# EasyEDA Pro project G-CU ver 2.0.B.eprj, board PCB1
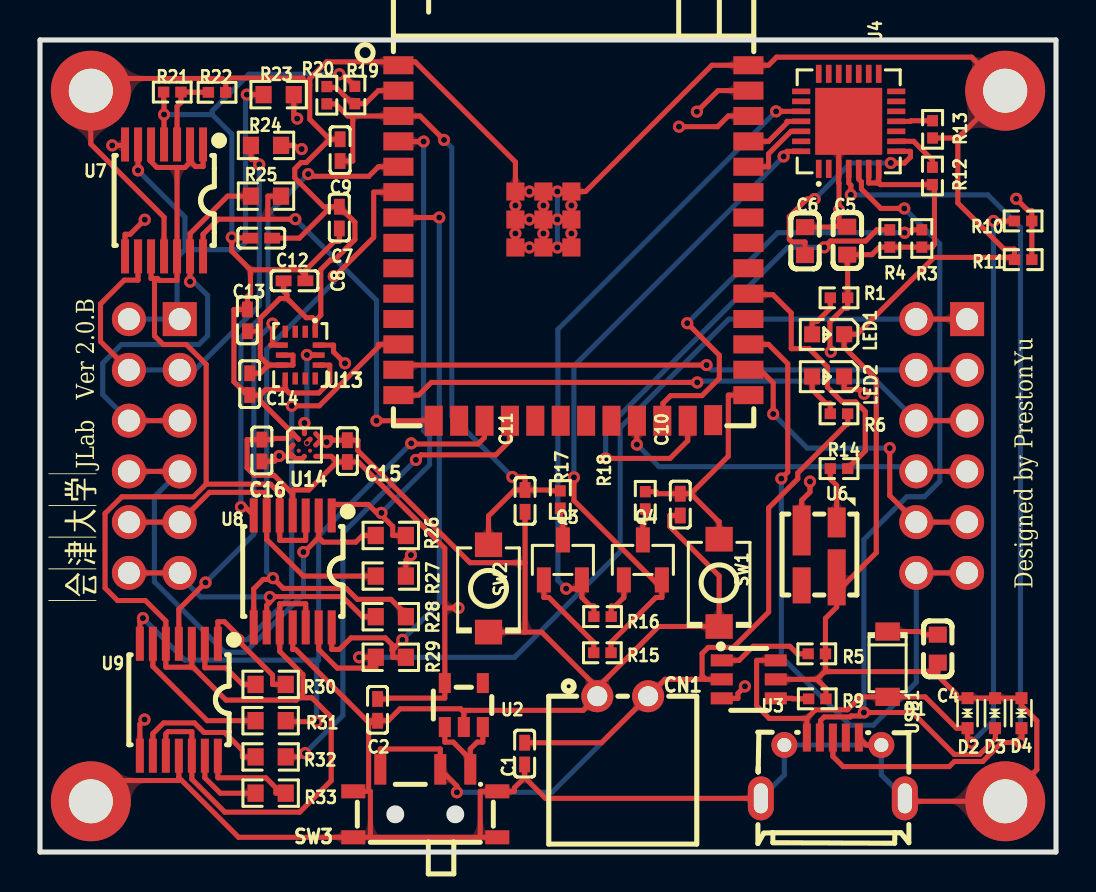
[diagram p2: board, top side]
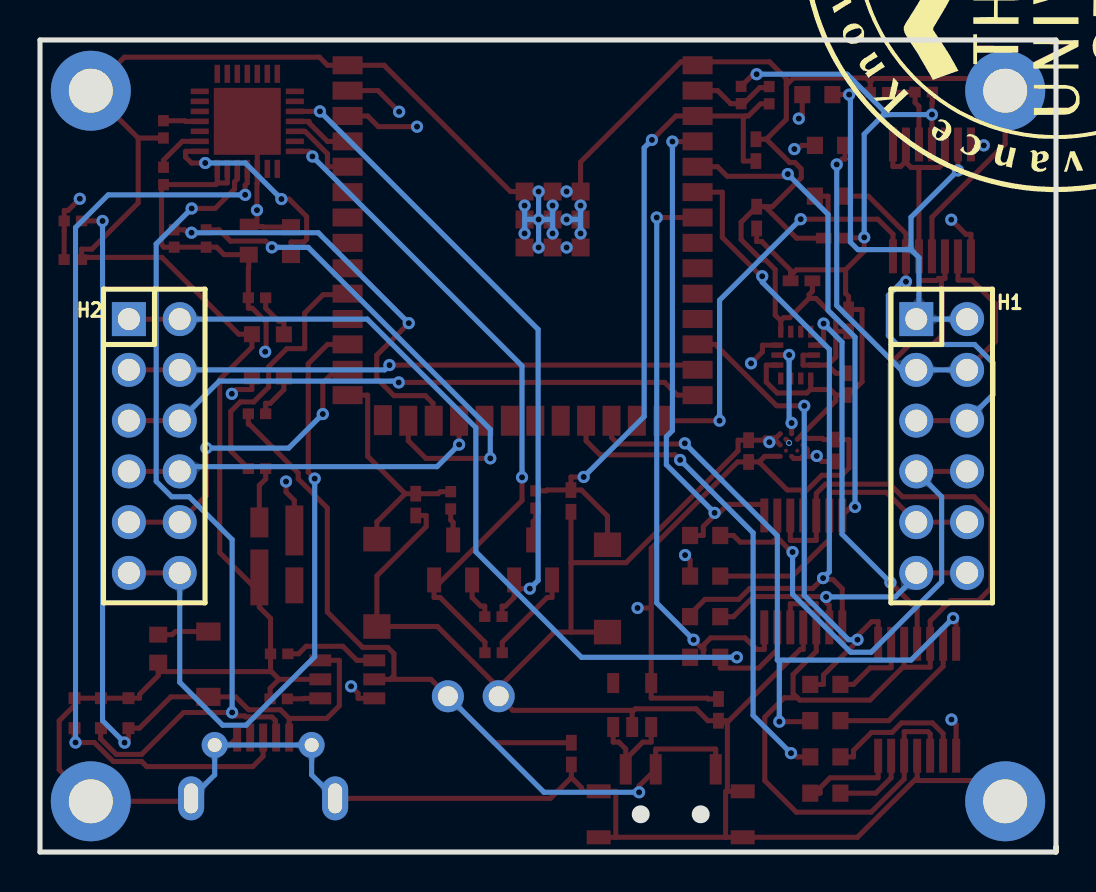
[diagram p3: board, bottom side, seen from below]

Outline 50.8 x 40.64 mm; copper layers: Top Layer, 地线屏蔽层, 信号层1, Bottom Layer. Coordinates in mm from the lower left corner of the outline.
Outline path: 0,40.64 0,0 50.8,0 50.8,40.64 0,40.64
Stack: Top Layer 0.035mm 外层铜厚1oz / Dielectric1 0.2104mm 7628 RC49% 8.6mil / 地线屏蔽层 0.035mm - / Dielectric2 1.065mm 1.1mm H/HOZ 含铜 / 信号层1 0.035mm - / Dielectric3 0.2104mm 7628 RC49% 8.6mil / Bottom Layer 0.035mm 外层铜厚1oz

## Design rules (mm)
template: JLCPCB Capability(Multiple Layers Board)
spacing copperThickness1oz (default): track to track 0.102, other pairs 0.152 to 0.3
spacing copperThickness2oz: track to track 0.203, other pairs 0.152 to 0.3
spacing copperThicknessInner0.5oz: track to track 0.089, other pairs 0.152 to 0.3
track width copperThickness1oz (default): min 0.102, default 0.254, max 2.54
track width copperThickness2oz: min 0.203, default 0.254, max 2.54
track width copperThickness0.5oz: min 0.089, default 0.254, max 2.54
differential pair differentialPair (default): width min 0.127, default 0.254, max 2.54; gap min 0.152, default 0.152
via viaSize (default): diameter min 0.3, default 0.61, max 10; hole min 0.2, default 0.305, max 6.3

## Placement (name value [footprint] x y rotation side)
C1  1uF  [c0402]  24.23 4.93 90 top
C2  1uF  [C0402]  16.88 7.11 90 top
C4  10uF  [C0603]  44.89 10.18 90 top
C5  10uF  [C0603]  40.36 30.59 270 top
C6  1uF  [C0603]  38.25 30.57 270 top
C7  10uF  [C0402]  14.97 31.75 270 top
C8  100pF  [C0402]  12.73 28.59 0 top
C9  1uF  [C0402]  15.01 35.12 270 top
C10  100pF  [C0402]  32.02 17.39 90 top
C11  100pF  [C0402]  24.25 17.57 90 top
C12  100pF  [C0402]  11.07 30.72 0 top
C13  100nF  [C0402]  10.37 26.61 90 top
C14  100nF  [C0402]  10.49 23.41 270 top
C15  100nF  [C0402]  15.37 20.07 270 top
C16  100nF  [C0402]  11.09 20.09 90 top
CN1  XH-2AW  [CONN-TH_XH-2AW_C2908611]  29.14 7.8 0 top
D1  1N5819HW-7-F  [SOD-123_L2.7-W1.6-LS3.7-RD]  42.38 9.4 270 top
D2  LESD5D5.0CT1G  [SOD-523_L1.2-W0.8-LS1.6-BI]  46.38 6.95 270 top
D3  LESD5D5.0CT1G  [SOD-523_L1.2-W0.8-LS1.6-BI]  47.75 6.95 270 top
D4  LESD5D5.0CT1G  [SOD-523_L1.2-W0.8-LS1.6-BI]  49.07 6.95 270 top
H1  PZ254V-12-12P  [HDR-TH_12P-P2.54-V-M-R2-C6-S2.54]  5.72 20.32 270 bottom
H2  PZ254V-12-12P  [HDR-TH_12P-P2.54-V-M-R2-C6-S2.54]  45.09 20.32 270 bottom
LED1  NCD0603R1  [LED0603-RD_RED]  39.41 25.91 180 top
LED2  NCD0603G1  [LED0603-RD]  39.41 23.8 180 top
NOREF  -  [Pad_e21]  48.26 2.54 0 top
NOREF#2  -  [Pad_e35]  48.26 38.1 0 top
NOREF#3  -  [Pad_e33]  2.54 2.54 0 top
NOREF#4  -  [Pad_e19]  2.54 38.1 0 top
Q3  L8050QLT1G  [SOT-23-3_L2.9-W1.3-P1.90-LS2.4-BR]  26.15 14.62 270 top
Q4  L8050QLT1G  [SOT-23-3_L2.9-W1.3-P1.90-LS2.4-BR]  30.14 14.62 270 top
R1  5.1kΩ  [R0402]  39.95 27.74 180 top
R3  4.7kΩ  [R0402]  44.09 30.7 270 top
R4  4.7kΩ  [R0402]  42.49 30.7 270 top
R5  10kΩ  [R0402]  38.84 9.92 180 top
R6  5.1kΩ  [R0402]  39.95 21.93 0 top
R9  680Ω  [R0402]  38.86 7.67 180 top
R10  22.1kΩ  [R0402]  49.16 31.58 180 top
R11  47.5kΩ  [R0402]  49.16 29.65 0 top
R12  1kΩ  [R0402]  44.62 33.83 270 top
R13  10kΩ  [R0402]  44.63 36.16 90 top
R14  0Ω  [R0402]  39.95 19.19 0 top
R15  10kΩ  [R0402]  28.12 9.97 180 top
R16  10kΩ  [R0402]  28.13 11.78 0 top
R17  0Ω  [R0402]  26.02 17.64 90 top
R18  0Ω  [R0402]  30.27 17.6 90 top
R19  0Ω  [R0402]  15.74 37.88 270 top
R20  10kΩ  [R0402]  14.34 37.87 90 top
R21  1.8kΩ  [R0402]  6.61 38.03 180 top
R22  200Ω  [R0402]  8.85 38.02 180 top
R23  5kΩ  [R0603]  11.93 37.9 0 top
R24  5kΩ  [R0603]  11.3 35.36 0 top
R25  5kΩ  [R0603]  11.3 32.82 0 top
R26  5kΩ  [R0603]  17.54 15.84 0 top
R27  5kΩ  [R0603]  17.54 13.81 0 top
R28  5kΩ  [R0603]  17.54 11.78 0 top
R29  5kΩ  [R0603]  17.54 9.75 0 top
R30  5kΩ  [R0603]  11.53 8.39 0 top
R31  5kΩ  [R0603]  11.53 6.57 0 top
R32  5kΩ  [R0603]  11.53 4.76 0 top
R33  5kΩ  [R0603]  11.53 2.95 0 top
SW1  TS-1088-AR02016  [SW-SMD_L3.9-W3.0-P4.45]  33.96 13.47 270 top
SW2  TS-1088-AR02016  [SW-SMD_L3.9-W3.0-P4.45]  22.43 13.19 270 top
SW3  MSK12C02  [SW-TH_MSK12C02]  19.27 2.44 0 top
U1  ESP32-S3-WROOM-1-N4  [WIRELM-SMD_ESP32-S3-WROOM-1]  26.67 30.48 0 top
U2  TLV75733PDBVR  [SOT-23-5_L2.9-W1.6-P0.95-LS2.8-BL]  21.19 7.36 0 top
U3  BQ21040DBVR  [SOT-23-6_L2.9-W1.6-P0.95-LS2.8-BR]  35.44 8.64 180 top
U4  CP2102N-A02-GQFN28  [QFN-28_L5.0-W5.0-P0.50-TL-EP3.3]  40.44 36.57 90 top
U6  SK6812mini  [LED-SMD_4P-L3.7-W3.5-P1.75-BR-SK6812MINI]  38.96 14.92 90 top
U7  OPA4314AIPWR  [TSSOP-14_L5.0-W4.4-P0.65-LS6.4-BL]  6.2 32.61 180 top
U8  OPA4314AIPWR  [TSSOP-14_L5.0-W4.4-P0.65-LS6.4-BL]  12.64 14.04 180 top
U9  OPA4314AIPWR  [TSSOP-14_L5.0-W4.4-P0.65-LS6.4-BL]  6.94 7.62 180 top
U13  BMI270  [LGA-14_L3.0-W2.5-P0.50-BR]  13.01 24.87 90 top
U14  BMM150  [WLCSP-12_L1.6-W1.6_BMM150]  13.22 20.37 90 top
USB1  MicroXNJ  [MICRO-USB-SMD_MICROXNJ]  39.64 4.21 0 top

## Footprints (pads in the part's own frame, mm; a bottom-side part is the same pattern mirrored in y, then rotated)
C0402
  rect 0.79x0.54 smd: 1(-0.545,0) 2(0.545,0)
c0402
  rect 0.79x0.54 smd: 1(-0.545,0) 2(0.545,0)
C0603
  rect 0.8x0.9 smd: 1(-0.7,0) 2(0.7,0)
CONN-TH_XH-2AW_C2908611
  round 1.6 hole 1: 1(-1.27,0) 2(1.27,0)
HDR-TH_12P-P2.54-V-M-R2-C6-S2.54
  rect 1.7x1.7 hole 1.1: 1(-6.35,-1.27)
  round 1.7 hole 1.1: 2(-6.35,1.27) 3(-3.81,-1.27) 4(-3.81,1.27) 5(-1.27,-1.27) 6(-1.27,1.27) 7(1.27,-1.27) 8(1.27,1.27) 9(3.81,-1.27) 10(3.81,1.27) 11(6.35,-1.27) 12(6.35,1.27)
LED0603-RD
  rect 0.8x0.8 smd: 1(-0.799,-0.004) 2(0.799,0.004)
LED0603-RD_RED
  rect 0.8x0.8 smd: 1(-0.799,-0.004) 2(0.799,0.004)
LED-SMD_4P-L3.7-W3.5-P1.75-BR-SK6812MINI
  rect 1.5x0.9 smd: 1(1.575,-0.875)
  rect 2.5x0.9 smd: 2(1.175,0.875)
  rect 1.8x0.9 smd: 3(-1.575,0.875)
  rect 2.8x0.9 smd: 4(-1.175,-0.875)
LGA-14_L3.0-W2.5-P0.50-BR
  rect 0.6x0.27 smd: 1(1.17,-0.75) 2(1.17,-0.25) 3(1.17,0.25) 4(1.17,0.75) 8(-1.17,0.75) 9(-1.17,0.25) 10(-1.17,-0.25) 11(-1.17,-0.75)
  rect 0.27x0.6 smd: 5(0.5,0.92) 6(0,0.92) 7(-0.5,0.92) 12(-0.5,-0.92) 13(0,-0.92) 14(0.5,-0.92)
MICRO-USB-SMD_MICROXNJ
  rect 0.4x1.4 smd: 1(-1.3,1.522) 2(-0.65,1.522) 3(0,1.522) 4(0.65,1.522) 5(1.3,1.522)
  round 1.3 hole 0.7: 6(2.425,1.149) 9(-2.425,1.149)
  oval 1.3x2.2 hole 0.7x1.5: 7(3.6,-1.522) 8(-3.6,-1.522)
Pad_e19
  round 4 hole 2.2: 42(0,0)
Pad_e21
  round 4 hole 2.2: 42(0,0)
Pad_e33
  round 4 hole 2.2: 42(0,0)
Pad_e35
  round 4 hole 2.2: 42(0,0)
QFN-28_L5.0-W5.0-P0.50-TL-EP3.3
  rect 0.905x0.28 smd: 1(-2.377,1.5) 2(-2.377,1) 3(-2.377,0.5) 4(-2.377,0) 5(-2.377,-0.5) 6(-2.377,-1) 7(-2.377,-1.5) 15(2.377,-1.5) 16(2.377,-1) 17(2.377,-0.5) 18(2.377,0) 19(2.377,0.5) 20(2.377,1) 21(2.377,1.5)
  rect 0.28x0.905 smd: 8(-1.5,-2.377) 9(-1,-2.377) 10(-0.5,-2.377) 11(0,-2.377) 12(0.5,-2.377) 13(1,-2.377) 14(1.5,-2.377) 22(1.5,2.377) 23(1,2.377) 24(0.5,2.377) 25(0,2.377) 26(-0.5,2.377) 27(-1,2.377) 28(-1.5,2.377)
  rect 3.35x3.35 smd: 29(0,0)
R0402
  rect 0.566x0.54 smd: 1(-0.433,0) 2(0.433,0)
R0603
  rect 0.806x0.864 smd: 1(-0.753,0) 2(0.753,0)
SOD-123_L2.7-W1.6-LS3.7-RD
  rect 0.91x1.22 smd: 1(-1.635,0) 2(1.635,0)
SOD-523_L1.2-W0.8-LS1.6-BI
  rect 0.6x0.6 smd: 1(-0.75,0) 2(0.75,0)
SOT-23-3_L2.9-W1.3-P1.90-LS2.4-BR
  rect 1.25x0.7 smd: 1(1,-0.95) 2(1,0.95) 3(-1,0)
SOT-23-5_L2.9-W1.6-P0.95-LS2.8-BL
  rect 0.6x1 smd: 1(-0.95,-1.1) 2(0,-1.1) 3(0.95,-1.1) 4(0.95,1.1) 5(-0.95,1.1)
SOT-23-6_L2.9-W1.6-P0.95-LS2.8-BR
  rect 1.1x0.6 smd: 1(1.35,-0.95) 2(1.35,0) 3(1.35,0.95) 4(-1.35,0.95) 5(-1.35,0) 6(-1.35,-0.95)
SW-SMD_L3.9-W3.0-P4.45
  rect 1.23x1.36 smd: 1(-2.185,0) 2(2.185,0)
SW-TH_MSK12C02
  rect 0.6x1.524 smd: 1(-2.25,1.7) 2(0.75,1.7) 3(2.25,1.7)
  rect 1.2x0.7 smd: 4(-3.6,0.6) 4(-3.6,-1.7) 4(3.6,0.6) 4(3.6,-1.7)
TSSOP-14_L5.0-W4.4-P0.65-LS6.4-BL
  rect 0.4x1.7 smd: 1(-1.95,-2.8) 2(-1.3,-2.8) 3(-0.65,-2.8) 4(0,-2.8) 5(0.65,-2.8) 6(1.3,-2.8) 7(1.95,-2.8) 8(1.95,2.8) 9(1.3,2.8) 10(0.65,2.8) 11(0,2.8) 12(-0.65,2.8) 13(-1.3,2.8) 14(-1.95,2.8)
WIRELM-SMD_ESP32-S3-WROOM-1
  rect 1.5x0.9 smd: 1(-8.75,8.895) 2(-8.75,7.625) 3(-8.75,6.355) 4(-8.75,5.085) 5(-8.75,3.815) 6(-8.75,2.545) 7(-8.75,1.275) 8(-8.75,0.005) 9(-8.75,-1.265) 10(-8.75,-2.535) 11(-8.75,-3.805) 12(-8.75,-5.075) 13(-8.75,-6.345) 14(-8.75,-7.615) 27(8.75,-7.615) 28(8.75,-6.345) 29(8.75,-5.075) 30(8.75,-3.805) 31(8.75,-2.535) 32(8.75,-1.265) 33(8.75,0.005) 34(8.75,1.275) 35(8.75,2.545) 36(8.75,3.815) 37(8.75,5.085) 38(8.75,6.355) 39(8.75,7.625) 40(8.75,8.895)
  rect 0.9x1.5 smd: 15(-6.985,-8.895) 16(-5.715,-8.895) 17(-4.445,-8.895) 18(-3.175,-8.895) 19(-1.905,-8.895) 20(-0.635,-8.895) 21(0.635,-8.895) 22(1.905,-8.895) 23(3.175,-8.895) 24(4.445,-8.895) 25(5.715,-8.895) 26(6.985,-8.865)
  rect 0.9x0.9 smd: 41(-2.9,2.575) 41(-2.9,1.175) 41(-2.9,-0.225) 41(-1.5,2.575) 41(-1.5,1.175) 41(-1.5,-0.225) 41(-0.1,2.575) 41(-0.1,1.175) 41(-0.1,-0.225)
WLCSP-12_L1.6-W1.6_BMM150
  round 0.2 smd: A1(0.566,0.566) A3(0.566,0) A5(0.566,-0.566) B2(0.283,0.283) B4(0.283,-0.283) C1(0,0.566) C5(0,-0.566) D2(-0.283,0.283) D4(-0.283,-0.283) E1(-0.566,0.566) E3(-0.566,0) E5(-0.566,-0.566)

## Nets
As in the schematic, except:
GND: C1.1 C2.1 C4.1 C5.1 C6.1 C7.1 C8.1 C9.1 C10.1 C11.1 C12.2 C13.1 C14.1 C15.1 C16.1 CN1.1 D2.1 D3.1 D4.1 LED1.1 NOREF.42 NOREF#2.42 NOREF#3.42 NOREF#4.42 R5.1 R9.1 R11.1 R13.1 R22.1 SW1.2 SW2.2 SW3.4 U1.1 U1.40 U1.41 U2.2 U3.5 U4.3 U4.29 U6.4 U7.11 U8.11 U9.11 U13.1 U13.6 U13.7 U14.A5 U14.C1 U14.C5 U14.E1 U14.E3 USB1.5 USB1.6 USB1.7 USB1.8 USB1.9
GIN3: H1.7 H1.8 R26.1 U8.2
GPIO4: R26.2 U1.4 U8.1

Pads without a net: U1 8 9 10 16 19 20 21 22; U2 4; U4 1 2 10 12 13 14 15 16 17 18 19 20 21 22 23 27; U6 3; U13 2 3 4 9 10 11; U14 D2 D4; USB1 4

## Via types
v1: diameter 0.61, hole 0.305, Top Layer to Bottom Layer, 86 vias
v2: diameter 0.305, hole 0.203, Top Layer to Bottom Layer, 1 via

## Routing (per net, layer and track width the routed paths; a pad name or vN(x,y) marks a point on that pad's centre or on a via; arc(x,y) is an arc through that point)
GND: length 326.3
  Top Layer w0.254: 14.54,32.3 14.97,32.3 15.75,31.52 15.75,30.65 14.72,29.63 14.52,29.63 14.04,29.15 14.04,26.87 13.76,26.6 ; 14.54,32.3 12.97,30.72 C12.2 ; 14.54,32.3 14.18,32.3 12.74,33.74 12.74,34.19 13.05,34.5 13.31,34.5 14.48,35.67 ; 14.43,20.61 v1(14.33,20.51) ; 14.43,20.61 C15.1 15.9,20.61 15.9,20.08 21.5,14.48 24.25,14.48 ; 14.43,20.61 14.54,20.73 14.07,20.73 14.03,20.69 ; 39.95,31.29 v1(39.95,32.12) 39.95,33.47 39.94,33.48 39.94,36.06 40.44,36.56 ; 39.95,31.29 C5.1 ; 39.95,31.29 39.66,31.29 39.64,31.27 38.25,31.27 ; 14.48,35.67 13.49,36.67 13.49,38.38 ; 14.48,35.67 15.01,35.67 ; 45.89,35.73 45.89,32.48 48.2,30.17 48.73,30.17 48.73,29.76 ; 45.89,35.73 R13.1 ; 45.89,35.73 NOREF#2.42 46.58,39.78 36.83,39.78 36.43,39.37 U1.40 33.6,39.37 27.28,33.05 U1.41 v1(25.87,33.05) U1.41 v1(24.47,33.05) 23.77,33.05 23.77,34.53 18.76,39.54 14.33,39.54 13.49,38.7 13.49,38.38 ; 14.03,20.69 14.03,20.61 U14.C5 ; 14.03,20.69 U14.A5 ; 27.87,8.22 30.93,11.29 SW1.2 33.96,13.82 31.49,16.29 31.49,16.84 32.01,16.84 ; 27.87,8.22 25.08,11.01 24.25,11.01 ; 27.87,8.22 27.87,7.8 27.16,7.09 21.27,7.09 21.19,7.01 ; C14.1 11.01,23.96 11.42,24.37 ; 6.94,3.72 9.93,0.74 SW3.4 16.52,0.74 ; 6.94,3.72 6.94,3.58 3.58,3.58 NOREF#3.42 ; 6.94,3.72 6.94,4.82 ; U7.11 6.2,31.77 2.54,35.43 NOREF#4.42 3.15,38.71 9.12,38.71 9.29,38.55 ; 39.84,13.74 39.84,13 ; 39.84,13 39.84,12.26 39.27,11.7 R5.1 39.27,9.07 ; 39.84,13 41.81,14.98 41.81,23.65 40.21,25.26 LED1.1 40.86,25.91 44.7,29.76 48.73,29.76 ; 12.35,27.71 12.35,27.89 12.18,28.06 12.18,28.59 ; 12.35,27.71 13.31,26.74 13.62,26.74 13.76,26.6 ; 12.35,27.71 12,27.7 11.01,26.71 11.01,26.06 ; 22.01,0.74 22.01,3.04 23.72,3.04 23.72,3.22 24.23,3.73 ; 22.01,0.74 SW3.4 ; 22.01,0.74 16.52,0.74 ; 11.42,24.37 12.65,24.37 12.65,24.87 12.09,24.87 ; 11.42,24.37 11.01,24.77 11.01,26.06 ; U14.C1 12.44,20.16 12.44,20.01 U14.E1 ; USB1.8 25.28,2.69 24.23,3.73 ; 40.94,5.73 41.32,5.36 42.07,5.36 ; 11.96,19.8 11.71,19.55 C16.1 ; 11.96,19.8 U14.E1 ; 11.96,19.8 v1(11.96,19.82) ; 39.27,9.07 39.31,9.03 44.89,9.03 ; 39.27,9.07 38.85,8.64 ; 23.77,31.66 v1(24.47,31.66) U1.41 v1(25.87,31.66) U1.41 ; 12.64,11.24 12.64,10.14 12.79,10.14 16.36,6.57 16.62,6.57 ; U14.E1 12.76,19.69 13.11,19.69 U14.E3 ; U2.2 21.19,7.01 ; 21.19,7.01 21.03,7.17 18,7.17 17.4,6.57 16.62,6.57 ; C4.1 44.89,9.03 ; 44.89,9.03 44.89,8.83 45.82,7.89 45.82,7.7 49.07,7.7 49.07,7.34 49.84,6.57 49.84,4.12 NOREF.42 43.39,2.54 USB1.7 ; 24.23,4.38 24.23,3.73 ; 48.73,29.76 R11.1 ; 15.66,3.04 16.43,3.04 ; 16.43,3.04 16.43,6.39 16.62,6.57 ; 16.43,3.04 16.52,3.04 16.52,0.74 ; 38.85,8.64 39.3,8.19 R9.1 ; 38.85,8.64 36.79,8.64 ; 11.01,26.06 C13.1 ; 9.29,38.02 9.29,38.55 ; 9.29,38.55 9.47,38.73 13.13,38.73 13.49,38.38 ; SW2.2 24.25,11.01 ; 24.25,11.01 24.25,14.48 ; 24.25,14.48 C11.1 ; 13.76,26.6 13.76,26.04 ; 26.57,30.25 v1(25.87,30.25) v1(24.47,30.25) 23.77,30.25
  信号层1 w0.254: v1(11.96,19.82) 13.64,19.82 v1(14.33,20.51) ; v1(26.57,32.35) 26.86,32.07 39.9,32.07 v1(39.95,32.12)
  Bottom Layer w0.254: U1.41 v1(25.87,31.66) ; U1.41 v1(26.57,30.95) ; U1.41 v1(26.57,32.35) ; v1(25.87,31.66) U1.41 ; v1(25.87,31.66) v1(25.87,33.05) ; v1(25.87,31.66) v1(25.87,30.25) ; U1.41 v1(25.17,32.35) ; U1.41 v1(25.17,30.95) ; v1(23.77,30.95) 23.77,31.66 ; 23.77,31.66 v1(24.47,31.66) ; 23.77,31.66 v1(23.77,32.35) ; USB1.8 37.22,3.86 USB1.9 42.07,5.36 42.07,3.86 USB1.7
VBAT: length 46.4
  Top Layer w0.254: 33.29,8.64 34.09,8.64 ; 33.29,8.64 31.25,8.64 28.08,5.47 24.23,5.47 ; 33.29,8.64 33.1,8.83 33.1,9.93 33.41,10.24 34.66,10.24 36.43,12.01 36.43,17.22 37.89,18.68 37.89,18.97 40.33,21.41 40.38,21.41 40.38,21.93 ; 17.02,4.14 17.02,5.16 20.02,5.16 20.02,4.14 20.85,3.31 v1(20.85,2.99)
  Bottom Layer w0.254: v1(20.85,2.99) 25.6,2.99 30.41,7.8
VBUS: length 44.5
  Top Layer w0.254: v1(47.67,31.58) R10.2 ; 36.79,9.59 35.83,9.59 35.83,7.32 36.46,6.69 38.34,6.69 ; 38.34,6.69 38.78,7.12 40.37,7.12 41.02,7.76 44.26,7.76 45.82,6.2 D2.2 46.38,5.65 46.4,5.65 v1(46.57,5.47) ; 38.34,6.69 38.34,5.73
  Bottom Layer w0.254: v1(47.67,31.58) 47.67,6.58 v1(46.57,5.47)
VCC_3V3: length 148.9
  Top Layer w0.254: U6.2 38.08,17.6 38.5,18.01 v1(38.5,18.54) ; 14.97,31.21 14.97,30.55 14.71,30.55 13.27,29.11 13.27,28.85 ; U14.A1 12.42,20.7 11.68,20.7 11.62,20.64 C16.2 10.35,20.64 10.35,19.22 10.71,18.85 11.71,18.85 12.64,17.92 ; U14.A1 U14.B2 ; U14.A1 11.01,22.58 11.01,22.87 ; v1(11.62,26.44) 11.62,25.45 11.54,25.37 U13.5 ; 10.52,29.14 9.59,30.07 v1(9.59,30.76) 9.62,30.73 10.52,30.73 ; 10.52,29.14 10.52,27.95 10.37,27.8 C13.2 9.7,27.15 9.7,23.53 10.36,22.87 11.01,22.87 ; 10.52,29.14 12.98,29.14 13.27,28.85 ; C8.2 13.27,28.85 ; 12.64,17.92 12.64,18.12 13.44,18.12 14.85,19.52 ; 12.64,17.92 12.64,16.84 ; 13.93,24.37 14.49,24.37 14.49,23.52 13.94,22.97 12.46,22.97 12.26,23.17 ; R19.1 15.13,38.92 v1(14.97,38.92) ; 20.24,12.21 U2.5 20.24,7.7 17.44,7.7 17.4,7.66 16.88,7.66 ; 20.24,12.21 20.24,15.2 15.92,19.52 C15.2 14.85,19.52 ; 20.24,12.21 v1(20.92,12.21) ; 14.85,19.52 14.57,19.8 U14.E5 ; 11.01,22.87 11.28,23.15 12.26,23.15 12.26,23.17 ; 41.94,33.55 41.86,33.48 41.44,33.48 41.44,34.19 ; 41.94,33.55 41.94,33.48 42.02,33.4 44.72,33.4 44.72,30.41 44.62,30.27 R3.2 41.97,30.27 41.59,29.89 C5.2 40.36,29.24 40.38,29.22 R1.1 40.38,27.21 40.18,27.21 39.5,26.53 39.5,25.08 v1(39.54,25.04) ; 41.94,33.55 41.94,34.19 ; 6.18,38.03 6.18,37.51 6.2,37.49 v1(6.2,36.91) U7.4 ; 12.26,23.17 U13.8 ; v1(8.28,13.49) 6.94,12.15 6.94,10.42
  信号层1 w0.254: v1(11.62,26.44) 11.62,28.73 v1(9.59,30.76) ; v1(20.92,12.21) 32.17,12.21 v1(38.5,18.54) 39.54,19.58 v1(39.54,25.04)
  Bottom Layer w0.254: 8.61,36.91 8.61,37.09 10.44,38.92 v1(14.97,38.92) ; 8.61,36.91 v1(6.2,36.91) ; 8.61,36.91 9.59,35.93 v1(9.59,30.76) ; v1(11.62,26.44) 10.7,25.52 10.7,15.91 v1(8.28,13.49)
VCC_5V: length 2.6
  Top Layer w0.254: 42.38,11.04 44.03,11.04 44.19,10.88 C4.2
CHIP_PU: length 34.7
  Top Layer w0.254: 15.53,36.83 15.38,36.83 14.78,37.44 R20.1 ; 15.53,36.83 U1.3 19,36.83 v1(20.2,35.64) ; 15.53,36.83 15.64,36.73 15.64,34.58 15.01,34.58 ; C11.2 25.45,18.12 25.49,18.07 26.02,18.07 ; C11.2 23.73,18.12 22.43,16.82 22.43,15.38 ; C11.2 24.25,18.77 v1(23.62,18.77)
  Bottom Layer w0.254: v1(20.2,35.64) 20.59,35.25 20.59,21.79 v1(23.62,18.77)
DTR: length 33.7
  Top Layer w0.254: Q4.2 31.09,13.19 ; 31.09,13.19 31.09,12.74 30.8,12.74 28.55,10.5 28.55,9.97 ; 31.09,13.19 26.7,17.59 v1(26.7,18.75) ; v1(37.18,34.81) 37.18,34.89 37.35,35.07 U4.28
  Bottom Layer w0.254: v1(37.18,34.81) 26.7,24.33 v1(26.7,18.75)
ESP_3V3: length 4.2
  Top Layer w0.254: U1.2 16.92,38.1 16.27,37.45 16.27,37.45 R19.2 15.61,37.45 14.81,38.26 14.39,38.26 R20.2
GIN0: length 23.9
  Top Layer w0.254: v1(4.9,34.11) 4.9,35.41 ; v1(10.34,37.9) R23.1
  Bottom Layer w0.254: v1(10.34,37.9) 10.28,37.84 10.28,30.52 9.91,30.15 7.25,30.15 ; 7.25,30.15 7.25,31.77 v1(4.9,34.11) ; 7.25,30.15 6.85,29.75 6.85,26.8 H1.1 4.45,26.67
GIN1: length 23.6
  Top Layer w0.254: 4.9,29.81 4.9,28.62 4.22,28.62 3.03,27.43 3.03,25.55 4.45,24.13 ; R24.1 10.55,34.68 10.7,34.68 v1(10.96,34.41)
  Bottom Layer w0.254: v1(10.96,34.41) 10.96,27.35 7.75,24.13 4.45,24.13
GIN2: length 21.2
  Top Layer w0.254: v1(7.5,28.54) U7.13 7.5,30.95 9.38,32.82 R25.1 ; H1.5 4.45,21.59
  Bottom Layer w0.254: v1(7.5,28.54) 7.69,28.54 8.38,27.85 8.38,25.84 7.94,25.4 4.07,25.4 3.14,24.47 3.14,22.9 4.45,21.59
GIN3: length 26.1
  Top Layer w0.254: 13.93,15.74 13.21,15.01 v1(13.17,15.01) ; 13.93,15.74 14.16,15.51 15.79,15.51 16.13,15.84 16.79,15.84 ; 13.93,15.74 13.93,16.84 ; 4.45,19.05 H1.7
  Bottom Layer w0.254: v1(13.17,15.01) 13.17,12.9 10.27,10 9.24,10 5.72,13.52 5.72,17.78 H1.7
GIN4: length 16.1
  Top Layer w0.254: 16.79,13.81 13.17,13.81 11.34,15.64 11.34,18 8.48,18 H1.9 4.45,16.51
GIN5: length 15.1
  Top Layer w0.254: 11.48,12.5 11.48,12.49 11.34,12.35 11.34,11.24 ; 11.48,12.5 11.48,12.76 v1(11.49,12.77) ; 11.48,12.5 11.76,12.78 15.12,12.78 16.13,11.78 16.79,11.78 ; 4.45,13.97 H1.11
  Bottom Layer w0.254: H1.11 6.98,13.81 8.03,12.77 v1(11.49,12.77)
GIN6: length 46.8
  Top Layer w0.254: 46.36,26.67 43.81,26.67 ; 13.93,11.24 13.93,10.14 14.86,9.21 16.79,9.21 16.79,9.74 v1(15.96,9.74)
  Bottom Layer w0.254: v1(15.96,9.74) 23.73,9.74 29.01,15.03 29.01,21.24 34.44,26.67 43.81,26.67
GIN7: length 4.1
  Top Layer w0.254: 8.24,10.42 8.24,9.22 9.29,9.22 10.12,8.39 10.78,8.39
GIN8: length 7.4
  Top Layer w0.254: 10.78,6.58 8.36,6.58 5.64,9.29 5.64,10.42
GIN9: length 7.4
  Top Layer w0.254: 5.64,4.82 5.64,5.93 6.18,6.46 7.72,6.46 8.2,5.98 9.22,5.98 10.12,5.09 10.12,4.76 10.78,4.76
GIN10: length 4
  Top Layer w0.254: U9.13 8.24,3.71 9.01,2.95 10.78,2.95
GPIO0: length 11.9
  Top Layer w0.254: R18.2 30.79,18.04 30.89,17.93 32.54,17.93 ; 35.42,22.86 34.42,22.86 34.42,19.81 32.54,17.93 ; 32.54,17.93 33.94,16.53 33.96,16.53 33.96,15.66
GPIO1: length 34.9
  Top Layer w0.254: U7.7 4.21,35.36 v1(3.61,35.36) ; v1(12.86,36.7) 12.69,36.88 12.69,37.9 ; v1(32.84,37.05) 33.9,38.1 U1.39
  信号层1 w0.254: v1(3.61,35.36) 11.52,35.36 v1(12.86,36.7) 13.2,37.05 v1(32.84,37.05)
GPIO2: length 35.8
  Top Layer w0.254: v1(13.08,35.18) 12.9,35.18 12.71,35.36 R24.2 ; U7.8 4.25,30.92 4.51,30.92 v1(5.24,31.64) ; U1.38 34.42,36.83 33.88,36.3 v1(31.95,36.3)
  信号层1 w0.254: v1(5.24,31.64) 9.55,31.64 v1(13.08,35.18) 14.2,36.3 v1(31.95,36.3)
GPIO3: length 22.5
  Top Layer w0.254: R25.2 11.39,32.82 11.39,31.67 ; 19.69,21.58 v1(16.82,21.58) ; 11.39,31.67 8.91,31.67 8.15,30.92 U7.14 ; 11.39,31.67 v1(12.77,31.67)
  Bottom Layer w0.254: v1(16.82,21.58) 16.82,27.61 v1(12.77,31.67)
GPIO4: length 26.3
  Top Layer w0.254: v1(19.18,35.55) 17.93,35.55 U1.4 ; v1(17.07,16.97) 16.99,16.89 16.99,16.81 ; 14.58,16.84 14.58,17.4 16.41,17.4 16.99,16.81 ; 16.99,16.81 17.11,16.81 17.64,16.29 17.64,15.84 R26.2
  Bottom Layer w0.254: v1(17.07,16.97) 19.48,19.38 19.48,20.79 19.18,21.09 v1(19.18,35.55)
GPIO5: length 34.3
  Top Layer w0.254: 10.69,16.84 10.26,17.27 v1(10.05,17.27) ; R27.2 18.3,14.61 v1(18.55,14.86) ; U1.5 16.92,34.29 16.44,33.82 13.52,33.82 v1(13.41,33.93)
  信号层1 w0.254: v1(18.55,14.86) 17.13,16.28 11.04,16.28 v1(10.05,17.27)
  Bottom Layer w0.254: v1(13.41,33.93) 11.4,31.91 11.4,27.12 10.05,25.77 v1(10.05,17.27)
GPIO6: length 33.1
  Top Layer w0.254: 10.69,11.73 10.69,13.17 11.16,13.64 11.58,13.64 v1(11.65,13.71) 12.16,13.19 15.32,13.19 15.86,12.65 17.55,12.65 18.4,11.79 ; v1(14.69,28.82) 14.74,28.82 16.68,30.76 16.68,33.02 U1.6
  Bottom Layer w0.254: v1(11.65,13.71) 11.33,14.02 11.33,25.16 14.69,28.52 v1(14.69,28.82)
GPIO7: length 30.5
  Top Layer w0.254: 17.6,10.11 17.64,10.08 17.64,9.74 R29.2 ; 17.6,10.11 17.6,10.38 17.27,10.72 15.55,10.72 14.97,10.14 14.58,10.14 14.58,11.24 ; 17.6,10.11 v1(18.12,10.62) ; U1.7 v1(19.96,31.75)
  Bottom Layer w0.254: v1(18.12,10.62) 19.96,12.47 v1(19.96,31.75)
GPIO8: length 26
  Top Layer w0.254: 8.89,10.42 8.89,11.53 9.22,11.53 9.92,10.82 v1(9.92,10.63) 9.92,10.56 11.63,8.86 11.63,8.39 12.29,8.39 ; U1.12 16.92,25.4 16.92,25.28 13.97,22.33 v1(12.59,22.33)
  Bottom Layer w0.254: v1(9.92,10.63) 10.37,10.63 12.59,12.84 v1(12.59,22.33)
GPIO9: length 33.1
  Top Layer w0.254: 4.99,10.42 4.99,11.56 v1(5.15,11.71) ; 22.22,21.58 22.22,20.74 21.9,20.42 18.59,20.42 v1(18.56,20.45) ; v1(13.83,6.52) 12.34,6.52 12.29,6.58
  Bottom Layer w0.254: v1(18.56,20.45) 13.93,15.83 13.93,9.61 ; v1(13.83,6.52) 13.83,9.51 13.93,9.61 ; 13.93,9.61 7.25,9.61 v1(5.15,11.71)
GPIO10: length 34.7
  Top Layer w0.254: 23.5,21.58 23.5,20.58 22.79,19.88 19.05,19.88 v1(18.79,19.62) ; U9.8 4.99,6.4 v1(5.23,6.63) ; v1(13.25,4.95) 13.13,4.95 12.95,4.76 12.29,4.76
  信号层1 w0.254: v1(5.23,6.63) 6.91,4.95 v1(13.25,4.95)
  Bottom Layer w0.254: v1(13.25,4.95) 15.15,6.84 15.15,15.97 v1(18.79,19.62)
GPIO11: length 5
  Top Layer w0.254: U9.14 8.89,3.71 11.29,3.71 11.8,3.21 11.8,2.95 12.29,2.95
GPIO19: length 28.6
  Top Layer w0.254: 46.36,24.13 43.81,24.13 ; v1(33.33,24.37) 18.16,24.37 U1.13
  Bottom Layer w0.254: v1(33.33,24.37) 33.57,24.13 43.81,24.13
GPIO20: length 29.5
  Top Layer w0.254: 17.92,22.86 18.93,22.86 19.56,23.5 v1(32.86,23.5) ; 46.36,21.59 43.81,21.59
  Bottom Layer w0.254: 43.81,21.59 41.83,23.57 32.93,23.57 v1(32.86,23.5)
GPIO21: length 18.3
  Top Layer w0.254: 46.36,19.05 43.81,19.05 ; v1(29.84,20.39) 29.84,21.58
  Bottom Layer w0.254: 43.81,19.05 43.58,19.28 30.95,19.28 v1(29.84,20.39)
GPIO35: length 16.4
  Top Layer w0.254: 46.36,16.51 43.81,16.51 42.49,17.84 v1(42.49,20.21) ; v1(36.66,21.92) 36.66,23.48 36.01,24.13 U1.28
  Bottom Layer w0.254: v1(36.66,21.92) 38.36,20.21 v1(42.49,20.21)
GPIO36: length 34.2
  Top Layer w0.254: U1.29 36.43,25.4 37.39,24.44 37.39,19.01 v1(37.07,18.69) ; 46.36,13.97 43.81,13.97
  Bottom Layer w0.254: v1(37.07,18.69) 37.07,9.78 40.5,6.35 41.67,6.35 43.81,8.49 43.81,13.97
GPIO38: length 13.1
  Top Layer w0.254: 35.45,27.89 36.65,27.89 37.56,26.97 37.56,25.19 38.46,25.19 39.37,24.28 39.37,23.27 40.11,22.52 40.79,22.52 41.26,22.05 41.26,20.07 40.37,19.18
RTS: length 32.8
  Top Layer w0.254: 27.1,13.18 v1(26.31,13.18) ; 27.1,13.18 27.1,13.62 ; 27.1,13.18 27.1,12.74 27.53,12.31 27.7,12.31 27.7,11.78 ; 38.06,37.06 v1(36.8,37.06)
  Bottom Layer w0.254: v1(26.31,13.18) 25.9,13.59 25.9,26.16 v1(36.8,37.06)
SCL: length 45.6
  Top Layer w0.254: v1(43.23,30.99) 43.42,30.99 43.57,31.14 R3.1 ; 31.12,21.58 31.15,21.61 31.15,22.46 31.53,22.84 33.1,22.84 33.96,23.7 33.96,24.86 v1(32.36,26.47) ; v1(13.34,24.88) 13.35,24.87 13.93,24.87 ; v1(13.22,21.47) U14.A3
  信号层1 w0.254: v1(13.34,24.88) 14.94,26.47 v1(32.36,26.47)
  Bottom Layer w0.254: v1(32.36,26.47) 36.89,30.99 v1(43.23,30.99) ; v1(13.34,24.88) 13.34,21.59 v1(13.22,21.47)
SDA: length 47.2
  Top Layer w0.254: v1(28.29,19.7) 31.5,19.7 32.38,20.58 32.38,21.58 ; v1(39.21,30.26) 39.52,30.57 41.28,30.57 41.84,31.14 42.49,31.14 ; v2(13.35,20.47) 13.35,20.5 13.51,20.66 ; U13.14 14.68,25.37 14.68,25.03 v1(15.25,24.46)
  信号层1 w0.254: v2(13.35,20.47) 14.59,21.72 14.59,23.8 v1(15.25,24.46) 23.53,24.46 v1(28.29,19.7)
  Bottom Layer w0.254: v1(39.21,30.26) 37.39,30.26 28.29,21.15 v1(28.29,19.7)
U0RXD: length 3.8
  Top Layer w0.254: U1.36 36.43,34.29 36.43,34.94 37.55,36.07 U4.26
U0TXD: length 3.1
  Top Layer w0.254: 38.06,36.56 37.35,36.56 37.35,36.49 36.43,35.56 U1.37
USB_D+: length 48
  Top Layer w0.254: 40.44,34.19 40.44,33.48 40.54,33.37 v1(40.54,32.89) ; 49.1,6.22 49.1,5.55 v1(49.02,5.48) 48.08,5.48 47.13,4.53 45.72,4.53 45.46,4.28 40.16,4.28 39.65,4.79 39.65,5.7
  Bottom Layer w0.254: v1(40.54,32.89) 47.39,32.89 49.02,31.25 v1(49.02,5.48)
USB_D-: length 43.2
  Top Layer w0.254: 40.94,34.19 40.94,33.67 41.07,33.54 41.07,33.18 42.04,32.21 v1(43.22,32.21) ; 47.77,6.2 47.77,5.67 46.99,4.89 45.72,4.89 43.62,6.98 v1(41.19,6.98) 41.02,6.81 40.55,6.81 40.52,6.76 39.21,6.76 39.03,6.59 39.03,5.74 38.98,5.69
  Bottom Layer w0.254: v1(43.22,32.21) 44.99,30.43 44.99,18.55 44.22,17.78 43.34,17.78 41.19,15.64 v1(41.19,6.98)
VOUT1: length 84.6
  Top Layer w0.254: 12.93,7.72 13.59,7.72 14.56,6.75 14.56,3.57 12.98,2 9.24,2 7.59,3.65 U9.12 7.59,6.02 6.4,6.02 6.29,5.91 6.29,4.82 ; 12.93,7.72 12.81,7.6 9.3,7.6 7.59,9.32 ; 12.93,7.72 13.15,7.94 13.15,8.88 11.99,10.04 11.99,12.43 13.28,12.43 13.28,11.24 ; 5.52,35.24 5.52,34.59 5.84,34.26 7.24,34.26 7.51,34.52 ; 5.88,28.7 5.55,28.7 U7.10 ; 5.88,28.7 5.98,28.6 6.85,28.6 U7.12 6.85,34.26 ; 5.88,28.7 5.73,28.55 5.73,25.83 6.16,25.4 7.31,25.4 8.31,24.41 8.31,18.41 ; 7.59,9.32 7.53,9.25 6.29,9.25 6.29,11.56 5.27,12.59 3.88,12.59 3.25,13.21 3.25,16.94 4.09,17.78 7.67,17.78 8.31,18.41 ; 7.59,9.32 7.59,10.42 ; 8.31,18.41 11.52,18.41 11.99,17.95 11.99,15.6 13.28,15.6 13.28,16.84 ; U7.1 8.15,34.3 7.77,34.3 7.5,34.57 U7.2
$1N2540: length 2.4
  Top Layer w0.254: R1.2 39.52,27.21 38.87,26.56 38.61,26.56 38.61,25.91
$1N5698: length 4.8
  Top Layer w0.254: 34.09,9.59 34.96,9.59 35.66,10.3 37.49,10.3 37.87,9.92 38.41,9.92
$1N5744: length 2.4
  Top Layer w0.254: 39.52,21.93 39.52,22.46 39.29,22.46 38.61,23.14 38.61,23.79
$1N5776: length 20.4
  Top Layer w0.254: LED2.1 40.21,23.15 40.99,23.15 v1(41.21,22.93) ; v1(35.25,8.29) 34.9,7.94 34.9,7.69 34.09,7.69
  信号层1 w0.254: v1(35.25,8.29) 41.21,14.25 v1(41.21,22.93)
$1N6032: length 1.7
  Top Layer w0.254: 36.79,7.69 37.6,7.69 37.62,7.67 38.43,7.67
$1N7305: length 21.4
  Top Layer w0.254: v1(42.54,34.48) 43.23,34.48 43.52,34.78 43.52,35.07 U4.8 ; 38.25,29.87 38.25,30.53 37.6,30.53 37.47,30.66 37.47,31.8 38.35,32.68 v1(38.73,32.68) ; R11.2 49.59,31.05 49.59,31.06 R10.1 49.59,32.11 49.4,32.11 v1(48.81,32.69)
  信号层1 w0.254: v1(48.81,32.69) 47.02,34.48 v1(42.54,34.48)
  Bottom Layer w0.254: v1(38.73,32.68) 40.53,34.48 v1(42.54,34.48)
$1N7502: length 2.6
  Top Layer w0.254: U4.9 43.68,35.57 44.62,34.63 R12.1
$1N7540: length 1.8
  Top Layer w0.254: 44.63,36.6 43.56,36.6 43.52,36.56 42.81,36.56
$1N7794: length 2.8
  Top Layer w0.254: 39.84,16.49 39.84,18.35 39.52,18.67 39.52,19.19
$1N8190: length 1.6
  Top Layer w0.254: 26.15,15.62 26.15,16.54 26.02,16.67 26.02,17.21
$1N8194: length 1.6
  Top Layer w0.254: 30.14,15.62 30.14,16.5 30.26,16.62 R18.1
$1N8229: length 4.8
  Top Layer w0.254: 25.2,13.62 25.2,12.74 25.44,12.74 27.69,10.5 27.69,9.97
$1N8232: length 2.2
  Top Layer w0.254: 28.56,11.78 28.56,12.31 28.76,12.31 29.19,12.74 Q4.1
$1N11489: length 4.1
  Top Layer w0.254: 8.42,38.02 7.59,38.02 7.58,38.03 7.05,38.03 7.05,37.51 6.85,37.31 U7.3
$1N12314: length 4.9
  Top Layer w0.254: U2.1 20.24,5.5 20.66,5.5 21.51,4.64 ; 21.51,4.14 21.51,4.64 ; 21.51,4.64 21.51,5.16 21.86,5.5 22.14,5.5 U2.3

## Copper pours and planes (outline as drawn; the poured copper is in the pictures)
GND on Top Layer: -0.01,40.68 50.81,40.68 50.81,0.23 -0.01,0.23
GND on Bottom Layer: -0.07,40.74 50.75,40.74 50.75,0.23 -0.07,0.23
GND on 地线屏蔽层: 0.26,40.38 50.54,40.38 50.54,0.26 0.26,0.26
GND on 信号层1: -0.01,40.74 50.81,40.74 50.81,0.16 -0.01,0.16

Small or netless copper shapes (teardrops, artwork), in the pictures only: 469 on Top Layer, 110 on Bottom Layer, 28 on 地线屏蔽层, 32 on 信号层1

## Text on the board
Top Silkscreen Layer: JLab   Ver 2.0.B | Designed by PrestonYu
